# EAGLE design Bus Solar V2 Packed with pads (EAGLE 8.5.0)
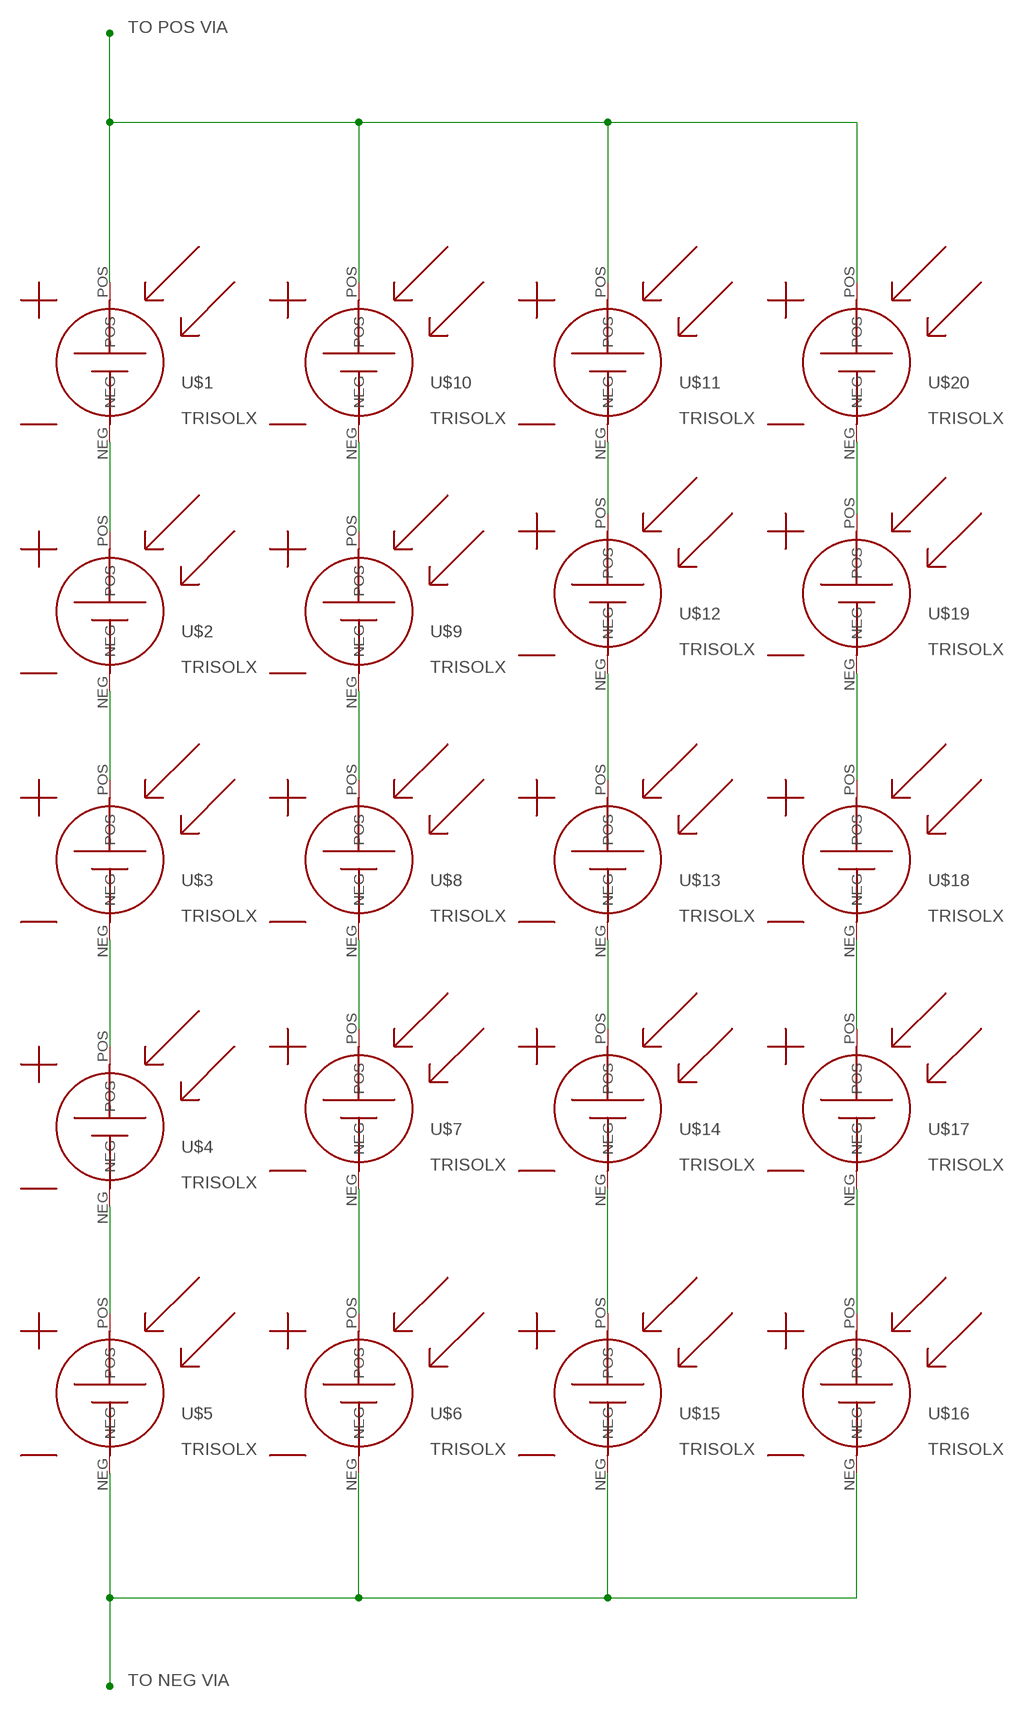
[diagram p0: schematic, sheet 1]

## Parts
U$1  TRISOLX  [TRISOLX]
U$2  TRISOLX  [TRISOLX]
U$3  TRISOLX  [TRISOLX]
U$4  TRISOLX  [TRISOLX]
U$5  TRISOLX  [TRISOLX]
U$6  TRISOLX  [TRISOLX]
U$7  TRISOLX  [TRISOLX]
U$8  TRISOLX  [TRISOLX]
U$9  TRISOLX  [TRISOLX]
U$10  TRISOLX  [TRISOLX]
U$11  TRISOLX  [TRISOLX]
U$12  TRISOLX  [TRISOLX]
U$13  TRISOLX  [TRISOLX]
U$14  TRISOLX  [TRISOLX]
U$15  TRISOLX  [TRISOLX]
U$16  TRISOLX  [TRISOLX]
U$17  TRISOLX  [TRISOLX]
U$18  TRISOLX  [TRISOLX]
U$19  TRISOLX  [TRISOLX]
U$20  TRISOLX  [TRISOLX]

## Nets
N$1: U$1.NEG U$2.POS
N$2: U$2.NEG U$3.POS
N$3: U$3.NEG U$4.POS
N$4: U$4.NEG U$5.POS
N$5: U$9.POS U$10.NEG
N$6: U$8.POS U$9.NEG
N$7: U$7.POS U$8.NEG
N$8: U$6.POS U$7.NEG
N$9: U$14.NEG U$15.POS
N$10: U$13.NEG U$14.POS
N$11: U$12.NEG U$13.POS
N$12: U$11.NEG U$12.POS
N$13: U$19.POS U$20.NEG
N$14: U$18.POS U$19.NEG
N$15: U$17.POS U$18.NEG
N$16: U$16.POS U$17.NEG
NEG: U$5.NEG U$6.NEG U$15.NEG U$16.NEG
POS: U$1.POS U$10.POS U$11.POS U$20.POS

## Notes on the sheet
- TO POS VIA
- TO NEG VIA

## Library data of the parts
U$1-U$20 = Parts:TRISOLX

## Board
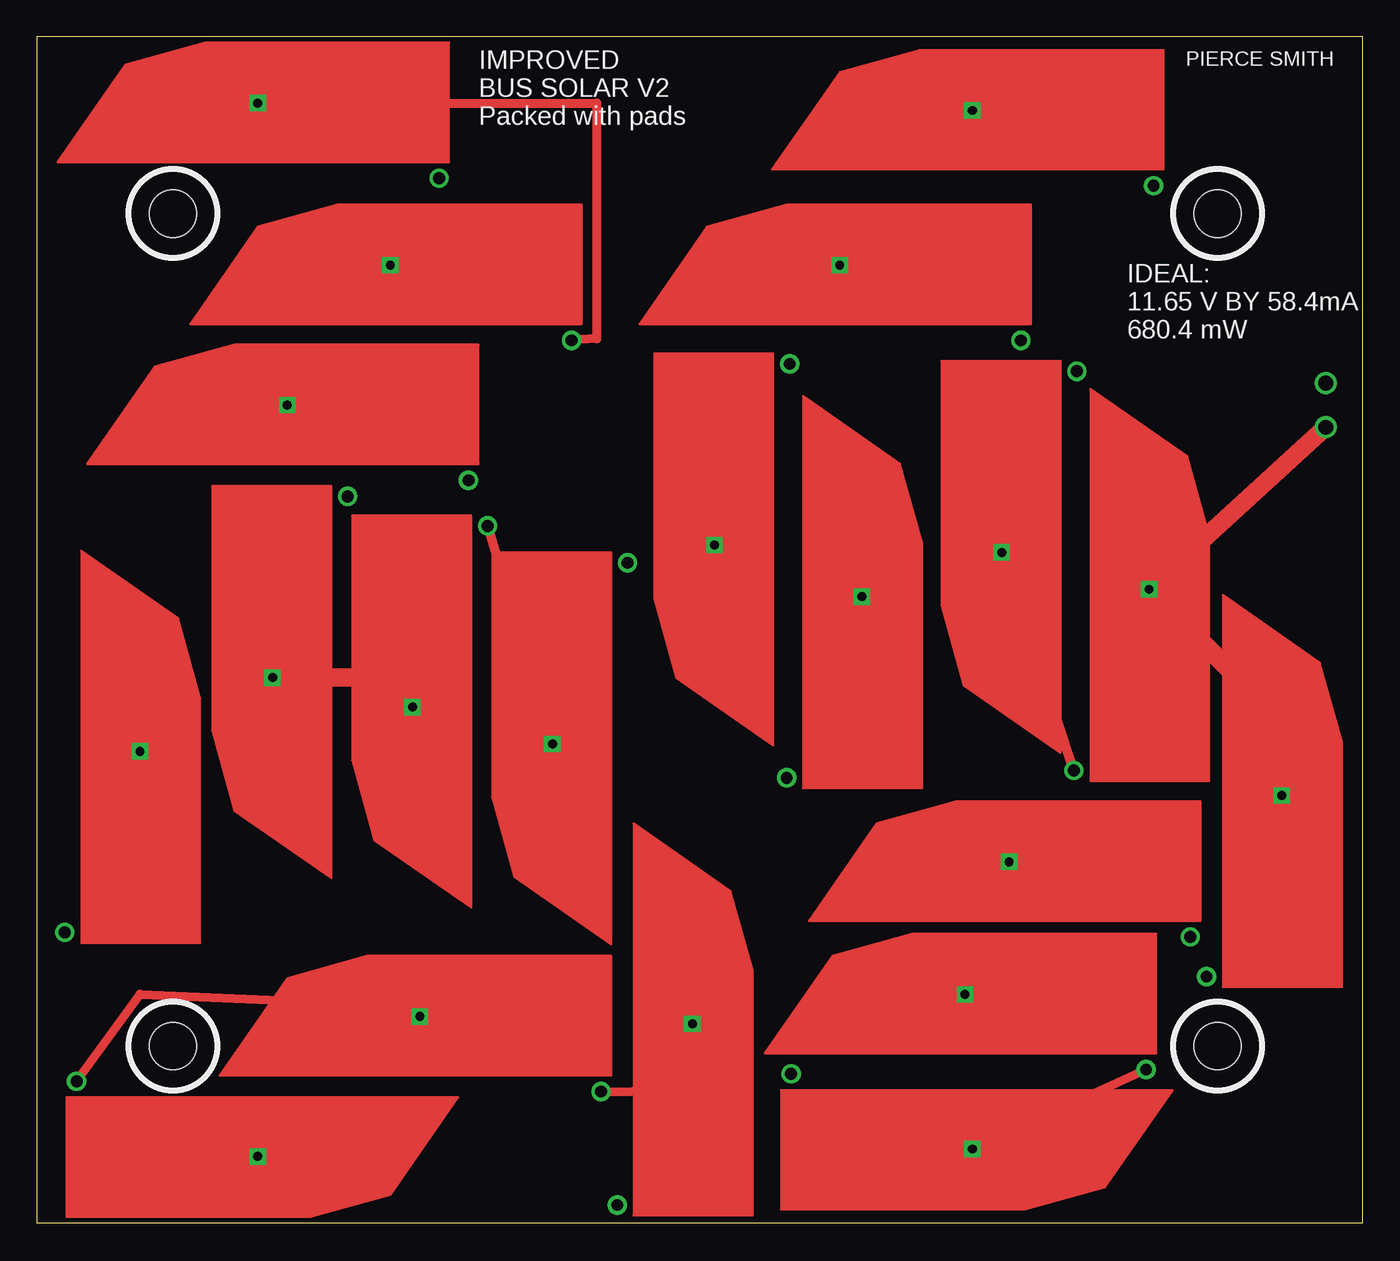
[diagram p1: board, top side]
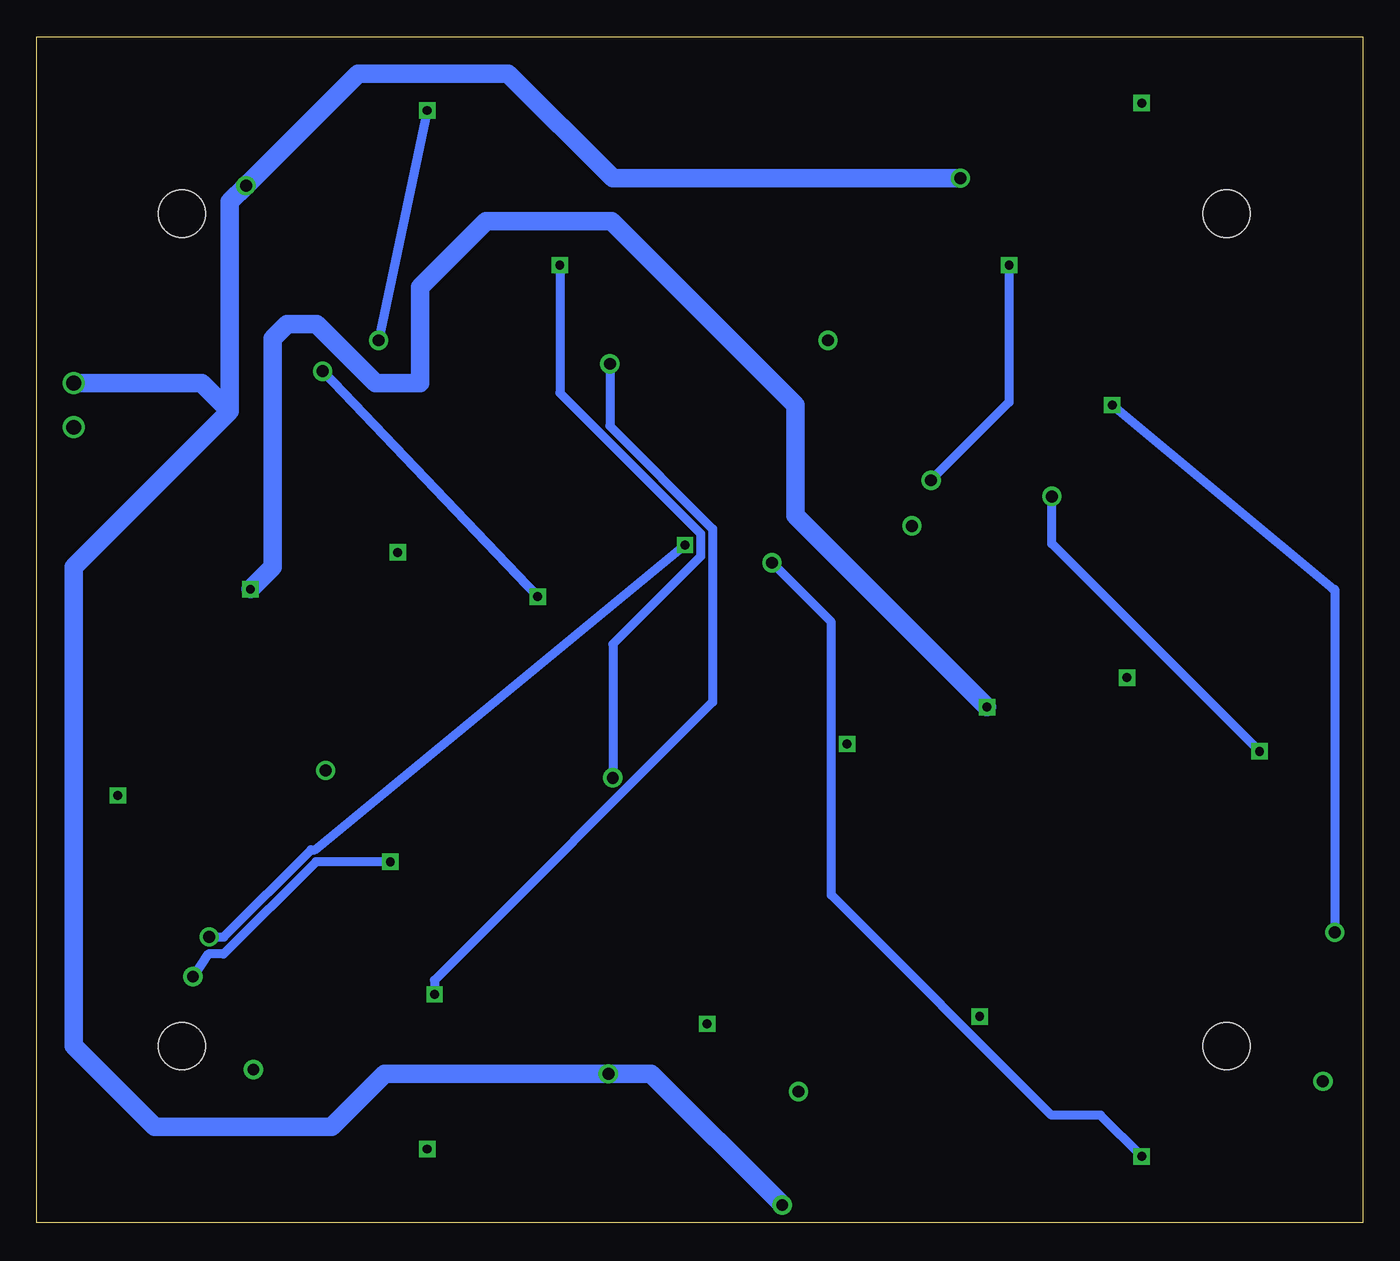
[diagram p2: board, bottom side, seen from below]

Size 90 x 80.5 mm. Coordinates in mm from the lower left corner, seen from the top.
Outline: 0,0 90,0 90,80.5 0,80.5 0,0
Copper layers (1*16): Top 0.035mm / dielectric 1.5mm / Bottom 0.035mm
Design rules "default": minimum track width 10mil, minimum drill 24mil, track to track 8mil, track to pad 8mil, pad to pad 8mil, via to via 8mil, smd to smd 8mil, copper to edge 40mil, drill to drill 8mil, minimum pad ring 10mil, minimum via ring 8mil, stop-mask expansion 4mil, vias tented up to drill 0mil, thermal gap 10mil
Holes 3.2 mm at 9.25,12 9.25,68.5 80.15,12 80.15,68.5

### Footprints (pad centres in the part's own frame; a part is rotated, then mirrored left to right if it is on the bottom)
TRISOLX = drill 0.6 square: NEG 0,0 | drill 0.8: POS 12.3,-5.1

### Placement (x,y rotation side)
U$1  15,76 0 top
U$2  24,65 0 top
U$3  17,55.5 0 top
U$4  7,32 270 top
U$5  16,37 90 top
U$6  25.5,35 90 top
U$7  35,32.5 90 top
U$8  15,4.5 180 top
U$9  26,14 0 top
U$10  44.5,13.5 270 top
U$11  63.5,5 180 top
U$12  63,15.5 0 top
U$13  46,46 90 top
U$14  66,24.5 0 top
U$15  84.5,29 270 top
U$16  75.5,43 270 top
U$17  65.5,45.5 90 top
U$18  56,42.5 270 top
U$19  54.5,65 0 top
U$20  63.5,75.5 0 top

### Tracks (layer width: path | path; a pad name or v marks a point on that pad's centre or on a via)
N$1
  Top 0.61: U$1.NEG 38,76 38,60 U$2.POS
N$2
  Bottom 0.61: U$2.NEG 24,55.7 U$3.POS
N$3
  Bottom 0.61: U$3.NEG 2,43 1.9,43 U$4.POS
N$4
  Bottom 0.61: U$4.NEG 21.1,46.1 U$5.POS
N$5
  Top 0.61: U$9.POS 44.5,9 U$10.NEG
N$6
  Top 0.61: U$8.POS 7,15.5 19,15 U$9.NEG
N$7
  Bottom 0.61: U$7.POS 36.06,40.76 36.06,22.24 21.13,7.3 17.8,7.3 U$8.NEG
N$8
  Top 0.61: U$6.POS U$7.NEG
N$9
  Bottom 0.61: U$14.NEG 71.06,24.5 77.32,18.24 78.36,18.24 U$15.POS
N$10
  Bottom 0.61: U$13.NEG 71.12,25.31 71.39,25.31 77.31,19.4 U$14.POS
N$11
  Bottom 0.61: U$13.POS 51.1,54.08 44.12,47.1 44.12,35.33 63,16.46 U$12.NEG
N$12
  Top 0.61: U$11.NEG U$12.POS
N$13
  Bottom 0.61: U$20.NEG U$19.POS
N$14
  Bottom 0.61: U$19.NEG 54.5,56.33 44.94,46.76 44.94,45.24 50.9,39.27 U$18.POS
N$15
  Bottom 0.61: U$17.POS U$18.NEG
N$16
  Top 0.61: U$16.POS U$17.NEG
NEG  (via drill 1)
  Top 1.27: v87.5,54 U$16.NEG 84.5,34 U$15.NEG | U$5.NEG 23.5,37 U$6.NEG
  Bottom 1.27: U$6.NEG 38.5,48 38.5,55.5 51,68 59.5,68 64,63.5 64,57 67,57 71,61 73,61 74,60 74,44.5 U$16.NEG
POS  (via drill 1)
  Bottom 1.27: U$1.POS 50.9,70.9 58,78 68.2,78 U$20.POS 76.9,69.3 76.9,55.1 | U$10.POS 48.3,10.1 U$11.POS 66.4,10.1 70,6.5 82,6.5 87.5,12 87.5,44.5 76.9,55.1 | v87.5,57 78.8,57 76.9,55.1

### Text on the board
tPlace: PIERCE SMITH | IMPROVED / BUS SOLAR V2 / Packed with pads | IDEAL: / 11.65 V BY 58.4mA / 680.4 mW